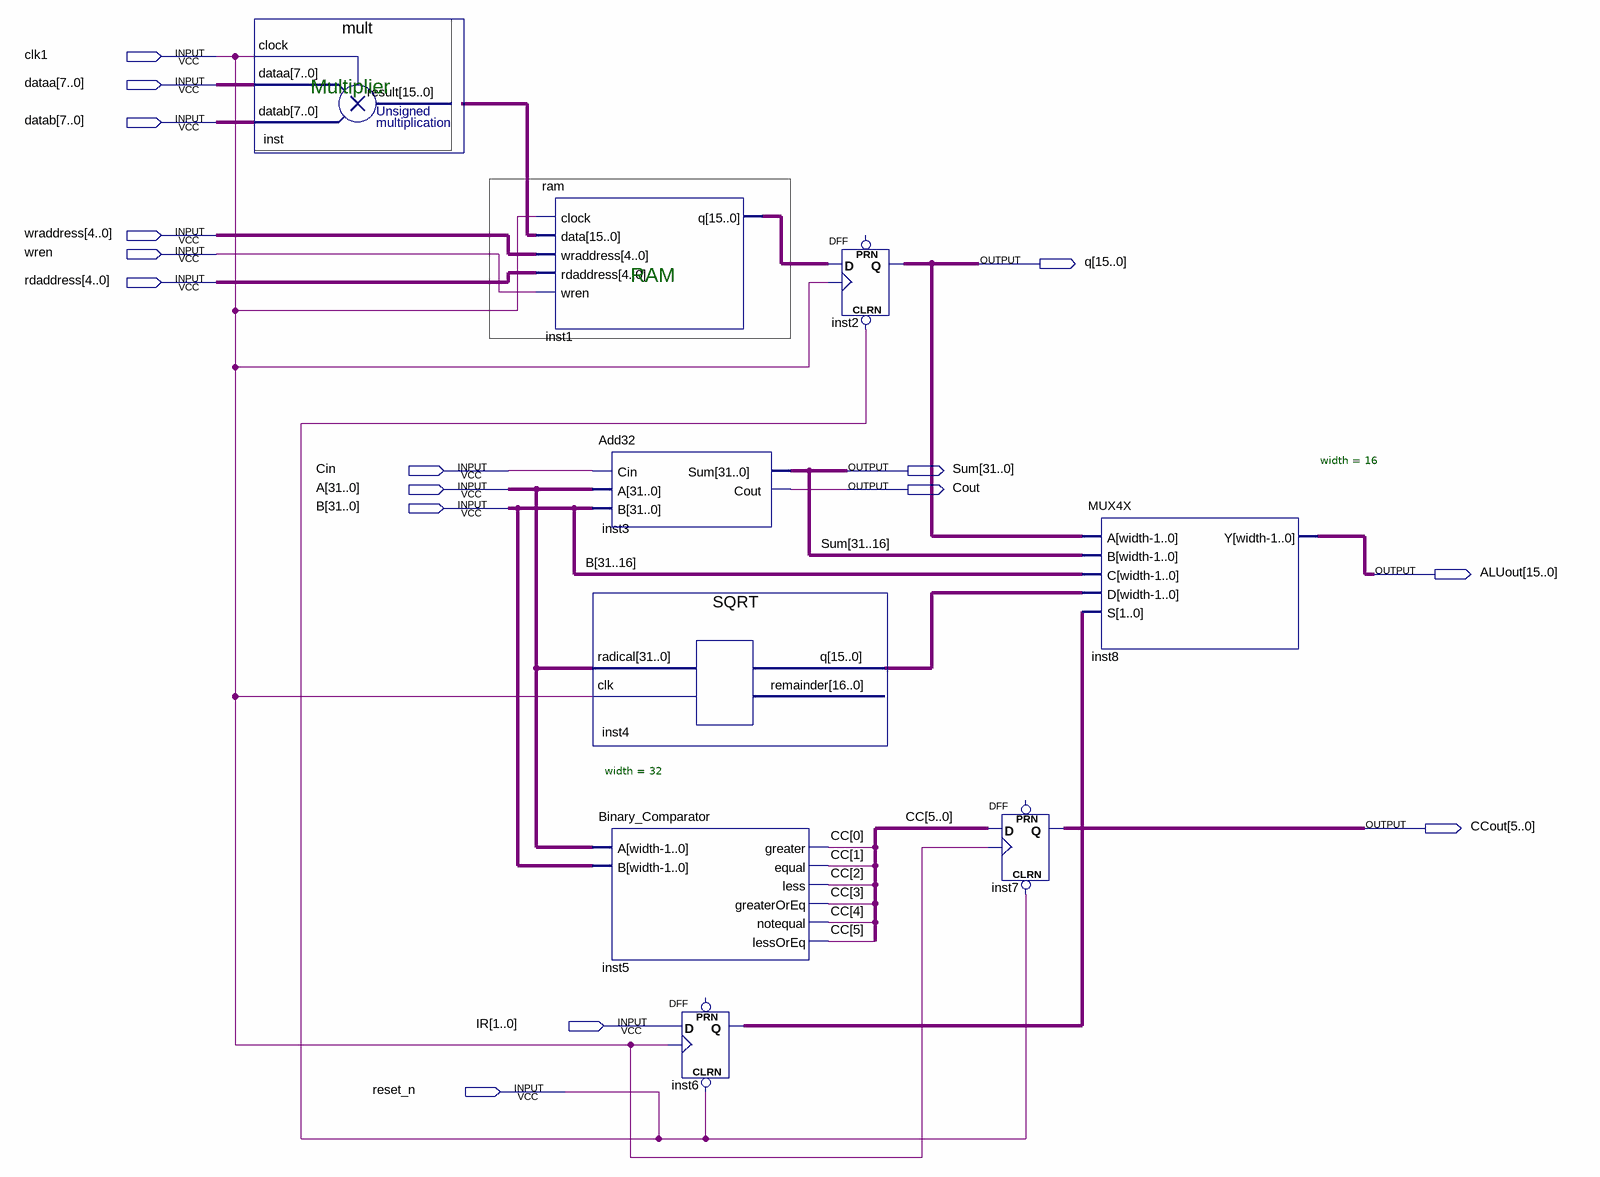
[diagram p0: schematic sheet]
// Quartus schematic pipemult.bdf as structural Verilog: 9 symbols, 16 pins
module pipemult (
  input  clk1,
  input  [7:0] dataa,
  input  [7:0] datab,
  input  [4:0] wraddress,
  input  wren,
  input  [4:0] rdaddress,
  input  Cin,
  input  [31:0] A,
  input  [31:0] B,
  input  [1:0] IR,
  input  reset_n,
  output [15:0] q,
  output [31:0] Sum,
  output Cout,
  output [15:0] ALUout,
  output [5:0] CCout
);

  wire [1:0] inst6_q;
  wire [5:0] CC;
  wire [15:0] inst1_q, inst4_q, inst_result;

  mult inst (.clock(clk1), .dataa(dataa), .datab(datab), .result(inst_result));
  ram inst1 (.clock(clk1), .data(inst_result), .wraddress(wraddress), .rdaddress(rdaddress), .wren(wren), .q(inst1_q));
  Add32 inst3 (.Cin(Cin), .A(A), .B(B), .Sum(Sum), .Cout(Cout));
  SQRT inst4 (.radical(A), .clk(clk1), .q(inst4_q));  // open: remainder
  Binary_Comparator #(.width(32)) inst5 (
    .A(A), .B(B), .greater(CC[0]), .equal(CC[1]), .less(CC[2]), .greaterOrEq(CC[3]), .notequal(CC[4]),
    .lessOrEq(CC[5]));
  DFF inst6[1:0] (.CLRN(reset_n), .CLK(clk1), .D(IR), .Q(inst6_q));  // open: PRN
  DFF inst2[15:0] (.CLRN(reset_n), .CLK(clk1), .D(inst1_q), .Q(q));  // open: PRN
  DFF inst7[5:0] (.CLRN(reset_n), .CLK(clk1), .D(CC), .Q(CCout));  // open: PRN
  MUX4X #(.width(16)) inst8 (.A(q), .B(Sum[31:16]), .C(B[31:16]), .D(inst4_q), .S(inst6_q), .Y(ALUout));

  // Notes on the sheet:
  //   Multiplier
  //   RAM
endmodule
